# Altium schematic sheet Power.SchDoc
size A
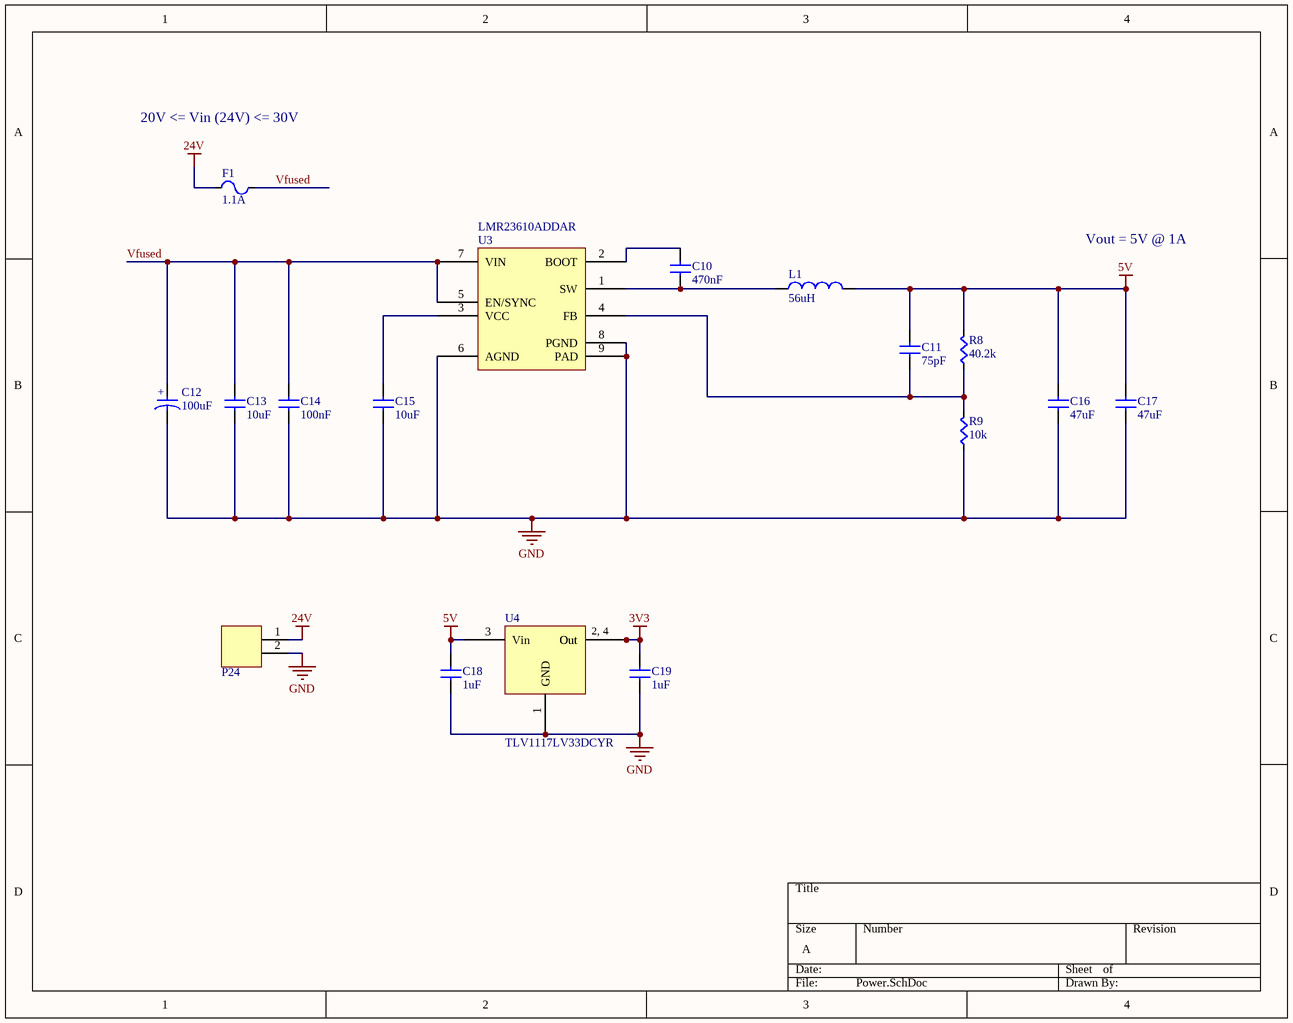
[diagram p0: Power.SchDoc]

## Parts
C10  value 470nF  [CAPC0603]  (hidden comment: Cap)
C11  value 75pF  [CAPC0603]  (hidden comment: Cap)
C12  value 100uF  [EEHZA1H101P]  (hidden comment: EEHZA1H101P)
C13  value 10uF  [CAP1210]  (hidden comment: Cap)
C14  value 100nF  [CAPC0603]  (hidden comment: Cap)
C15  value 10uF  [CAPC0603]  (hidden comment: Cap)
C16  value 47uF  [CAP1210]  (hidden comment: Cap)
C17  value 47uF  [CAP1210]  (hidden comment: Cap)
C18  value 1uF  [CAPC0603]  (hidden comment: Cap)
C19  value 1uF  [CAPC0603]  (hidden comment: Cap)
F1  value 1.1A  [PTC7451X11N]  (hidden comment: PTC Fuse)
L1  value 56uH  [MSS1048-563MLB]  (hidden comment: MSS1048-563MLB)
P24  2-pin Vert Sherlock  [MOLEX-HDR-1X2-SHERLOCK-VERT]  (value not drawn)
R8  value 40.2k  [RES0603]  (hidden comment: Res)
R9  value 10k  [RES0603]  (hidden comment: Res)
U3  LMR23610ADDAR  [LMR23610ADDAR]
U4  TLV1117LV33DCYR  [SOT23-4N]

## Nets
3V3: C19.1(A) U4.2(Out) U4.4(Out)
5V: C11.1(A) C16.1(A) C17.1(A) C18.1(A) L1.2 R8.1(A) U4.3(Vin)
24V: F1.1(A) P24.1
GND: C12.2 C13.2(B) C14.2(B) C15.2(B) C16.2(B) C17.2(B) C18.2(B) C19.2(B) P24.2 R9.2(B) U3.6(AGND) U3.8(PGND) U3.9(PAD) U4.1(GND)
Vfused: C12.1 C13.1(A) C14.1(A) F1.2(B) U3.5(EN/SYNC) U3.7(VIN)
NetC10_1: C10.1(A) U3.2(BOOT)
NetC10_2: C10.2(B) L1.1 U3.1(SW)
NetC11_2: C11.2(B) R8.2(B) R9.1(A) U3.4(FB)
NetC15_1: C15.1(A) U3.3(VCC)

## Notes on the sheet
- 20V <= Vin (24V) <= 30V
- Vout = 5V @ 1A
- (in symbol EEHZA1H101P) +
- (in symbol TLV1117LV33DCYR) 2, 4

## Library data of the parts
C12 = EEHZA1H101P: CAP ALUM POLY HYB 100UF 50V SMD; Manufacturer 1: Panasonic; Tolerance: 20%; Supplier 1: Digi-Key; Supplier Part Number 1: P15442CT-ND; Manufacturer Part Number 1: EEHZA1H101P; Voltage: 50V; ComponentLink1URL: https://na.industrial.panasonic.com/products/capacitors/aluminum-electrolytic-capacitors/conductive-polymer-hybrid-aluminum-electrolytic/series/za-high-temp-reflow/ABA0135/model/EEHZA1H101P; ComponentLink1Description: Web Site; ComponentLink2URL: https://industrial.panasonic.com/cdbs/www-data/pdf/RDD0000/ABA0000C1221.pdf; ComponentLink2Description: Data Sheet; ComponentLink3URL: https://industrial.panasonic.com/cdbs/www-data/pdf/RDD0000/ABA0000COS44.pdf; ComponentLink3Description: ZA Series Technical Data
C18 C19 = Cap: Manufacturer Part Number: C0603C105K8PACTU; Supplier 1: Digi-Key; Supplier Part Number 1: 399-3118-1-ND
F1 = PTC_Fuse: Supplier 1: Digi-Key; Supplier Part Number 1: 507-1744-1-ND
L1 = MSS1048-563MLB: FIXED IND 56UH 1.7A 126 MOHM; Manufacturer 1: Coilcraft; Manufacturer Part Number 1: MSS1048-563MLB; ComponentLink1Description: Web Site; ComponentLink1URL: https://www.coilcraft.com/mss1048.cfm; Supplier 1: Coilcraft; Supplier Part Number 1: MSS1048-563MLB
P24 = MOLEX-HDR-1x2-SHERLOCK_VERT: Header, Molex, 2mm Pitch Sherlock Header, Single Row, Vertical, 2 Circuits, Length 3.3mm, 0353620250; Manufacturer Part Number: *; Order Part Number: *
U3 = LMR23610ADDAR: IC REG BUCK ADJ 1A SYNC 8SOPWRPD; Manufacturer 1: Texas Instruments; Supplier 1: Digi-Key; Supplier Part Number 1: 296-47267-1-ND; Manufacturer Part Number 1: LMR23610ADDAR; ComponentLink1URL: http://www.ti.com/lit/ds/symlink/lmr23610.pdf; ComponentLink1Description: Datasheet; ComponentLink2URL: http://www.ti.com/product/LMR23610/description; ComponentLink2Description: Web Site
U4 = TLV1117LV33DCYR: IC REG LINEAR 3.3V 1A SOT223-4; Digi-Key Part Number: 296-28778-1-ND
C10 C11 C13-C17 = Cap: Supplier 1: Digi-Key
  C14: Supplier Part Number 1: 1276-1000-1-ND
  C16 C17: Supplier Part Number 1: 490-6538-1-ND
R8 R9 = Res: Supplier 1: Digi-Key
  R8: Supplier Part Number 1: RMCF0603FT40K2CT-ND
  R9: Supplier Part Number 1: RMCF0603JT10K0CT-ND